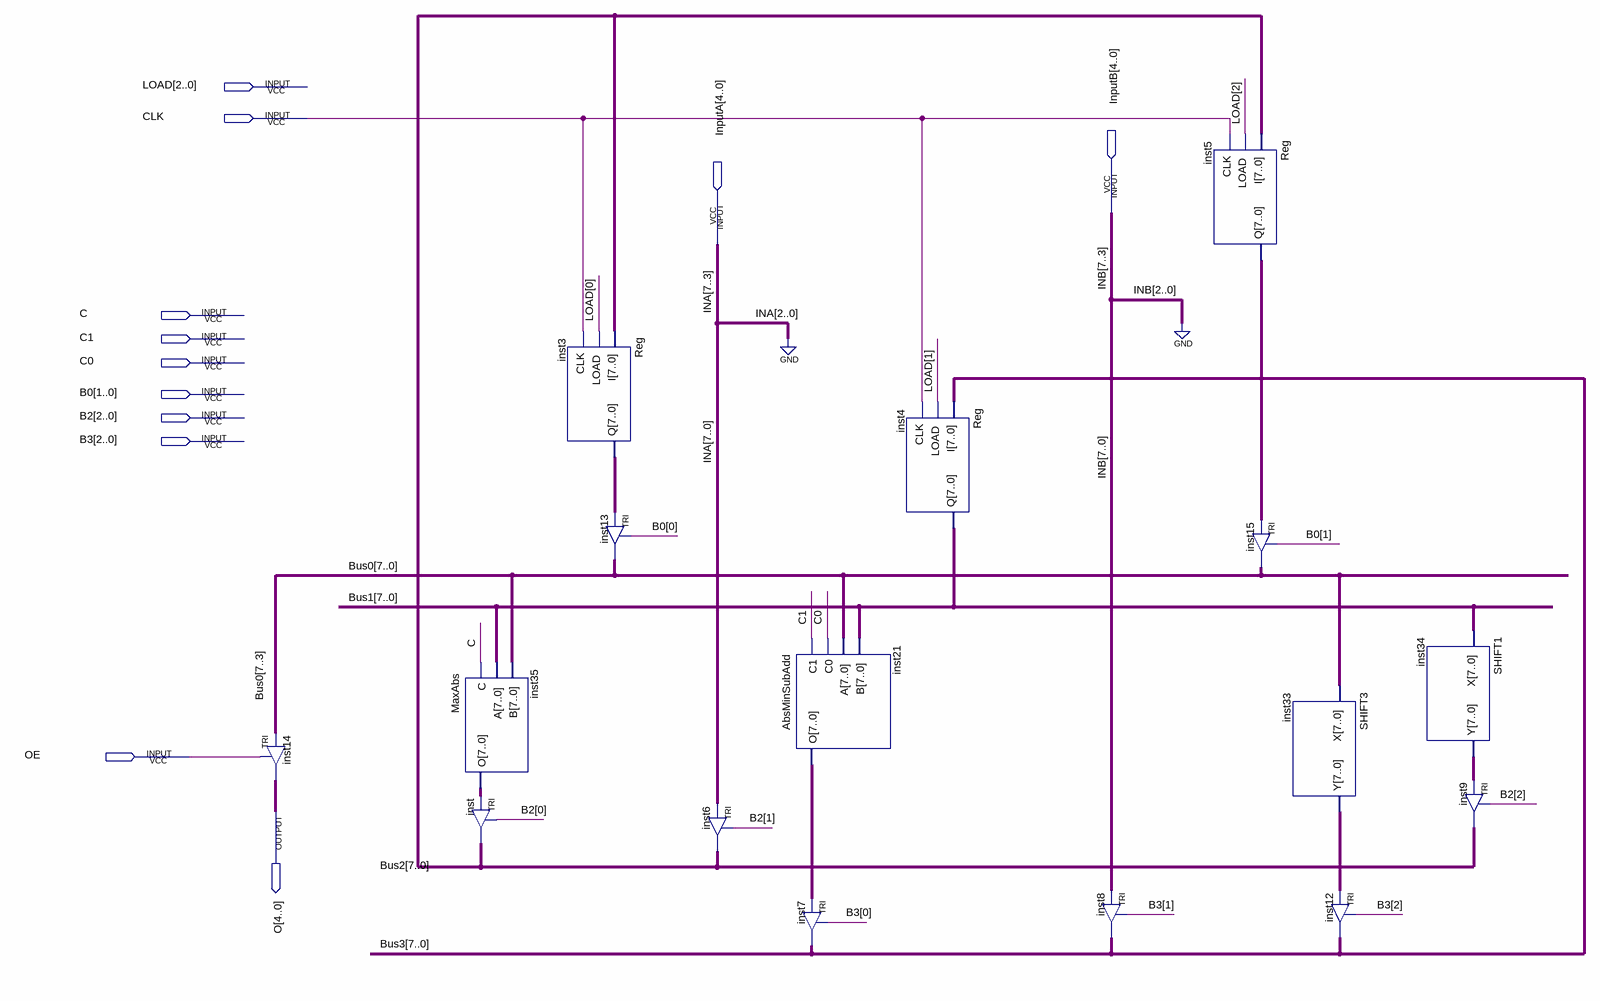
[diagram p0: schematic sheet]
// Quartus schematic CMISRAD.bdf as structural Verilog: 16 symbols, 12 pins
module CMISRAD (
  input  [2:0] LOAD,
  input  CLK,
  input  [4:0] InputB,
  input  [4:0] InputA,
  input  C,
  input  C1,
  input  C0,
  input  [1:0] B0,
  input  [2:0] B2,
  input  [2:0] B3,
  input  OE,
  output [4:0] O
);

  wire [7:0] Bus0, Bus1, Bus2, Bus3, inst3_q, inst5_q, inst21_o, inst33_y, inst34_y, inst35_o;

  TRI inst14[4:0] (.IN(Bus0[7:3]), .OE(OE), .OUT(O));
  MaxAbs inst35 (.C(C), .A(Bus1), .B(Bus0), .O(inst35_o));
  TRI inst[7:0] (.IN(inst35_o), .OE(B2[0]), .OUT(Bus2));
  Reg inst3 (.I(Bus2), .LOAD(LOAD[0]), .CLK(CLK), .Q(inst3_q));
  TRI inst13[7:0] (.IN(inst3_q), .OE(B0[0]), .OUT(Bus0));
  TRI inst6[7:0] (.IN({InputA, 3'b000}), .OE(B2[1]), .OUT(Bus2));
  AbsMinSubAdd inst21 (.C1(C1), .C0(C0), .A(Bus0), .B(Bus1), .O(inst21_o));
  TRI inst7[7:0] (.IN(inst21_o), .OE(B3[0]), .OUT(Bus3));
  Reg inst4 (.I(Bus3), .LOAD(LOAD[1]), .CLK(CLK), .Q(Bus1));
  TRI inst8[7:0] (.IN({InputB, 3'b000}), .OE(B3[1]), .OUT(Bus3));
  Reg inst5 (.I(Bus2), .LOAD(LOAD[2]), .CLK(CLK), .Q(inst5_q));
  TRI inst15[7:0] (.IN(inst5_q), .OE(B0[1]), .OUT(Bus0));
  SHIFT3 inst33 (.X(Bus0), .Y(inst33_y));
  TRI inst12[7:0] (.IN(inst33_y), .OE(B3[2]), .OUT(Bus3));
  SHIFT1 inst34 (.X(Bus1), .Y(inst34_y));
  TRI inst9[7:0] (.IN(inst34_y), .OE(B2[2]), .OUT(Bus2));

  // Other names for the same wires on the sheet: INA[7:3] = InputA; INB[7:3] = InputB
endmodule
